# EAGLE design EMP-3 (EAGLE 5.11)
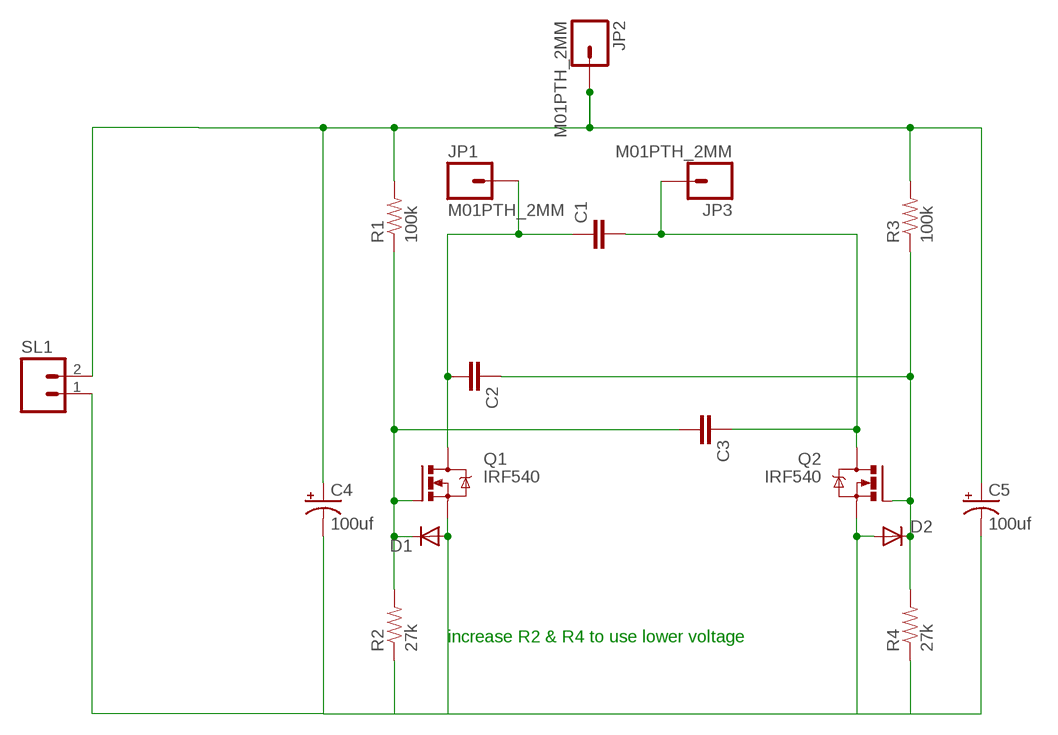
[diagram p0: schematic, sheet 1]

## Parts
C1  CAPPTH3  [CAP-PTH-LARGE]
C2  CAPPTH3  [CAP-PTH-LARGE]
C3  CAPPTH3  [CAP-PTH-LARGE]
C4  100uf  CAP_POLPTH1  [CPOL-RADIAL-100UF-25V]
C5  100uf  CAP_POLPTH1  [CPOL-RADIAL-100UF-25V]
D1  DIODESMA  [SMA-DIODE]
D2  DIODESMA  [SMA-DIODE]
JP1  M01PTH_2MM  [1X01_2MM]
JP2  M01PTH_2MM  [1X01_2MM]
JP3  M01PTH_2MM  [1X01_2MM]
Q1  IRF540  [TO220BV]
Q2  IRF540  [TO220BV]
R1  100k  RESISTOR0805-RES  [0805]
R2  27k  RESISTOR0805-RES  [0805]
R3  100k  RESISTOR0805-RES  [0805]
R4  27k  RESISTOR0805-RES  [0805]
SL1  M02  [02P]

## Nets
GND: C4.2(-) C5.2(-) D1.A D2.A Q1.S Q2.S R2.1 R4.1 SL1.1
N$2: C3.2 D1.C Q1.G R1.1 R2.2
N$5: C1.2 C3.1 JP3.1 Q2.D
N$7: C2.1 D2.C Q2.G R3.1 R4.2
N$9: C1.1 C2.2 JP1.1 Q1.D
VCC: C4.1(+) C5.1(+) JP2.1 R1.2 R3.2 SL1.2

## Notes on the sheet
- increase R2 & R4 to use lower voltage

## Library data of the parts
C1-C3 = SparkFun:CAP: Capacitor Standard 0603 ceramic capacitor, and 0.1" leaded capacitor.
C4 C5 = SparkFun:CAP_POL: Capacitor Polarized These are standard SMD and PTH capacitors. Normally 10uF, 47uF, and 100uF in electrolytic and tantalum varieties. Always verify the external diameter of the through hole cap, it varies with capacity, voltage, and manufacturer. The EIA devices should be standard.
D1 D2 = SparkFun:DIODE: Diode These are standard reverse protection diodes and small signal diodes. SMA package can handle up to about 1A. SOD-323 can handle about 200mA. What the SOD-323 package when ordering, there are some mfgs out there that are 5-pin packages.
JP1-JP3 = SparkFun:M01: Header 1 Standard 1-pin 0.1" header. Use with straight break away headers (SKU : PRT-00116), right angle break away headers (PRT-00553), swiss pins (PRT-00743), machine pins (PRT-00117), and female headers (PRT-00115).
Q1 Q2 = transistor-power:IRF540: HEXFET Power MOSFET
R1-R4 = SparkFun:RESISTOR: Resistor Basic schematic elements and footprints for 0603, 1206, and PTH resistors.
SL1 = EMP-2:M02: AMP QUICK CONNECTOR; OC_FARNELL: unknown; OC_NEWARK: unknown

## Board
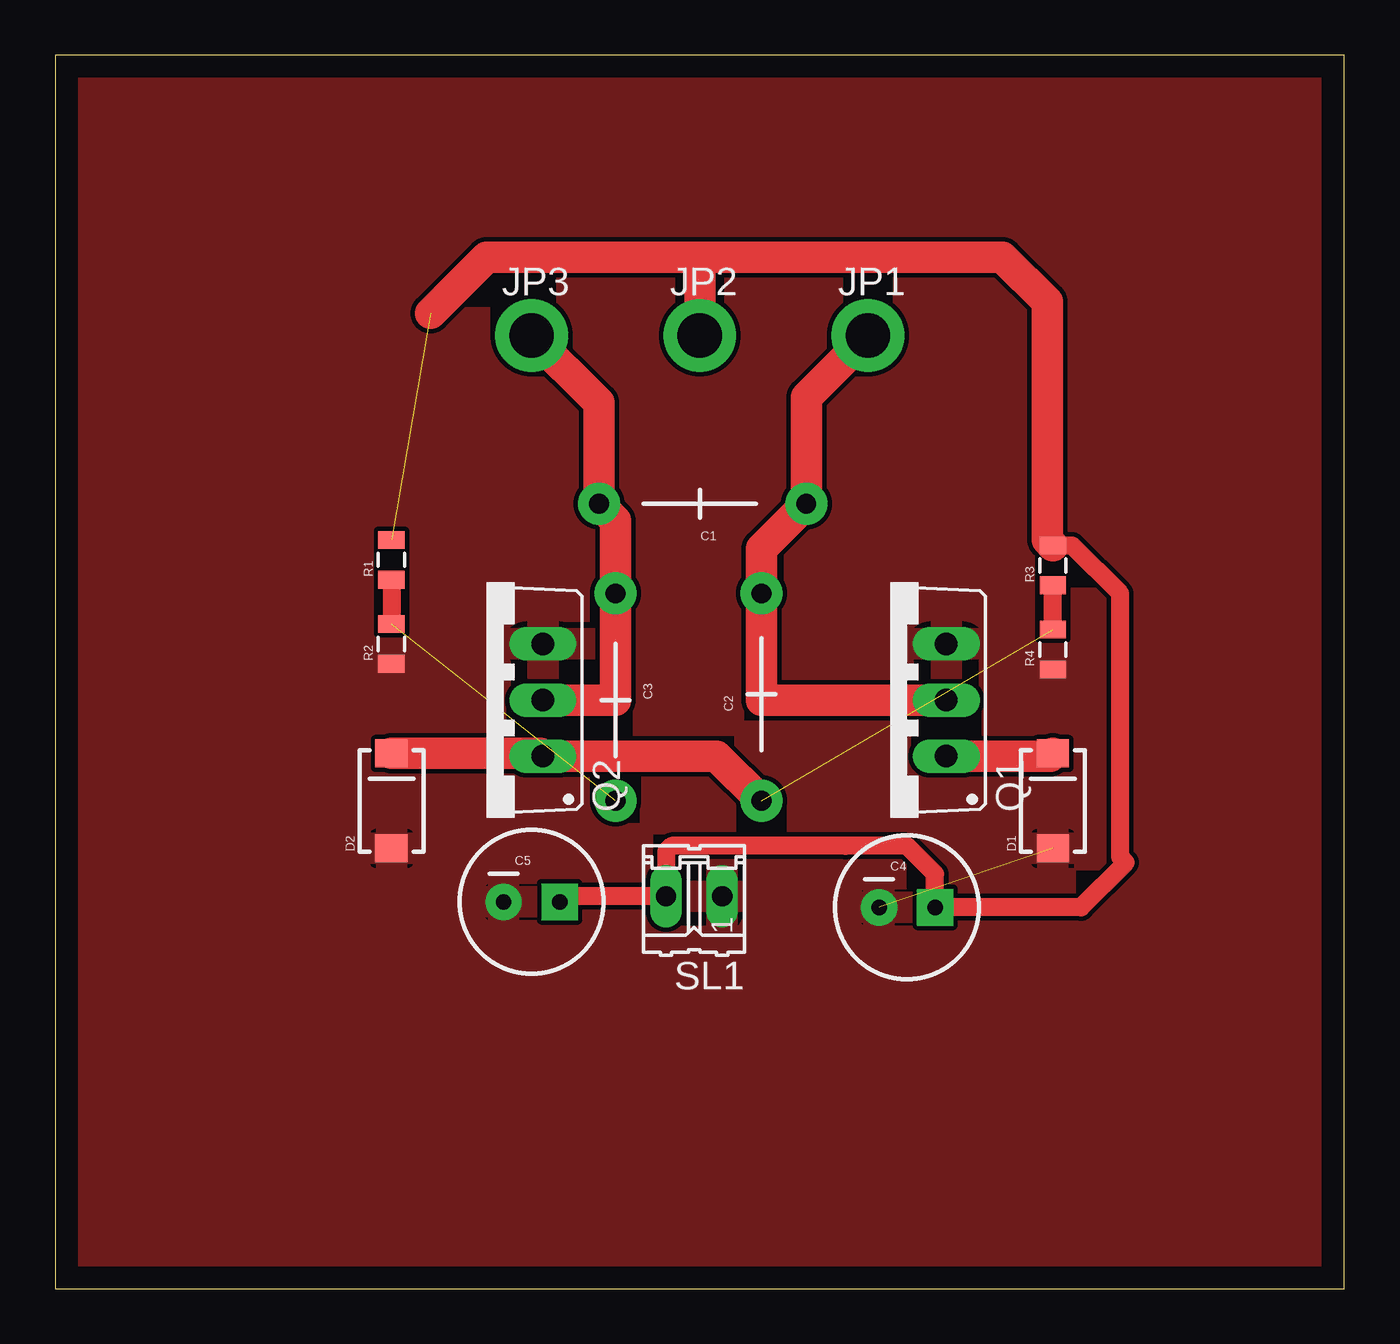
[diagram p1: board, top side]
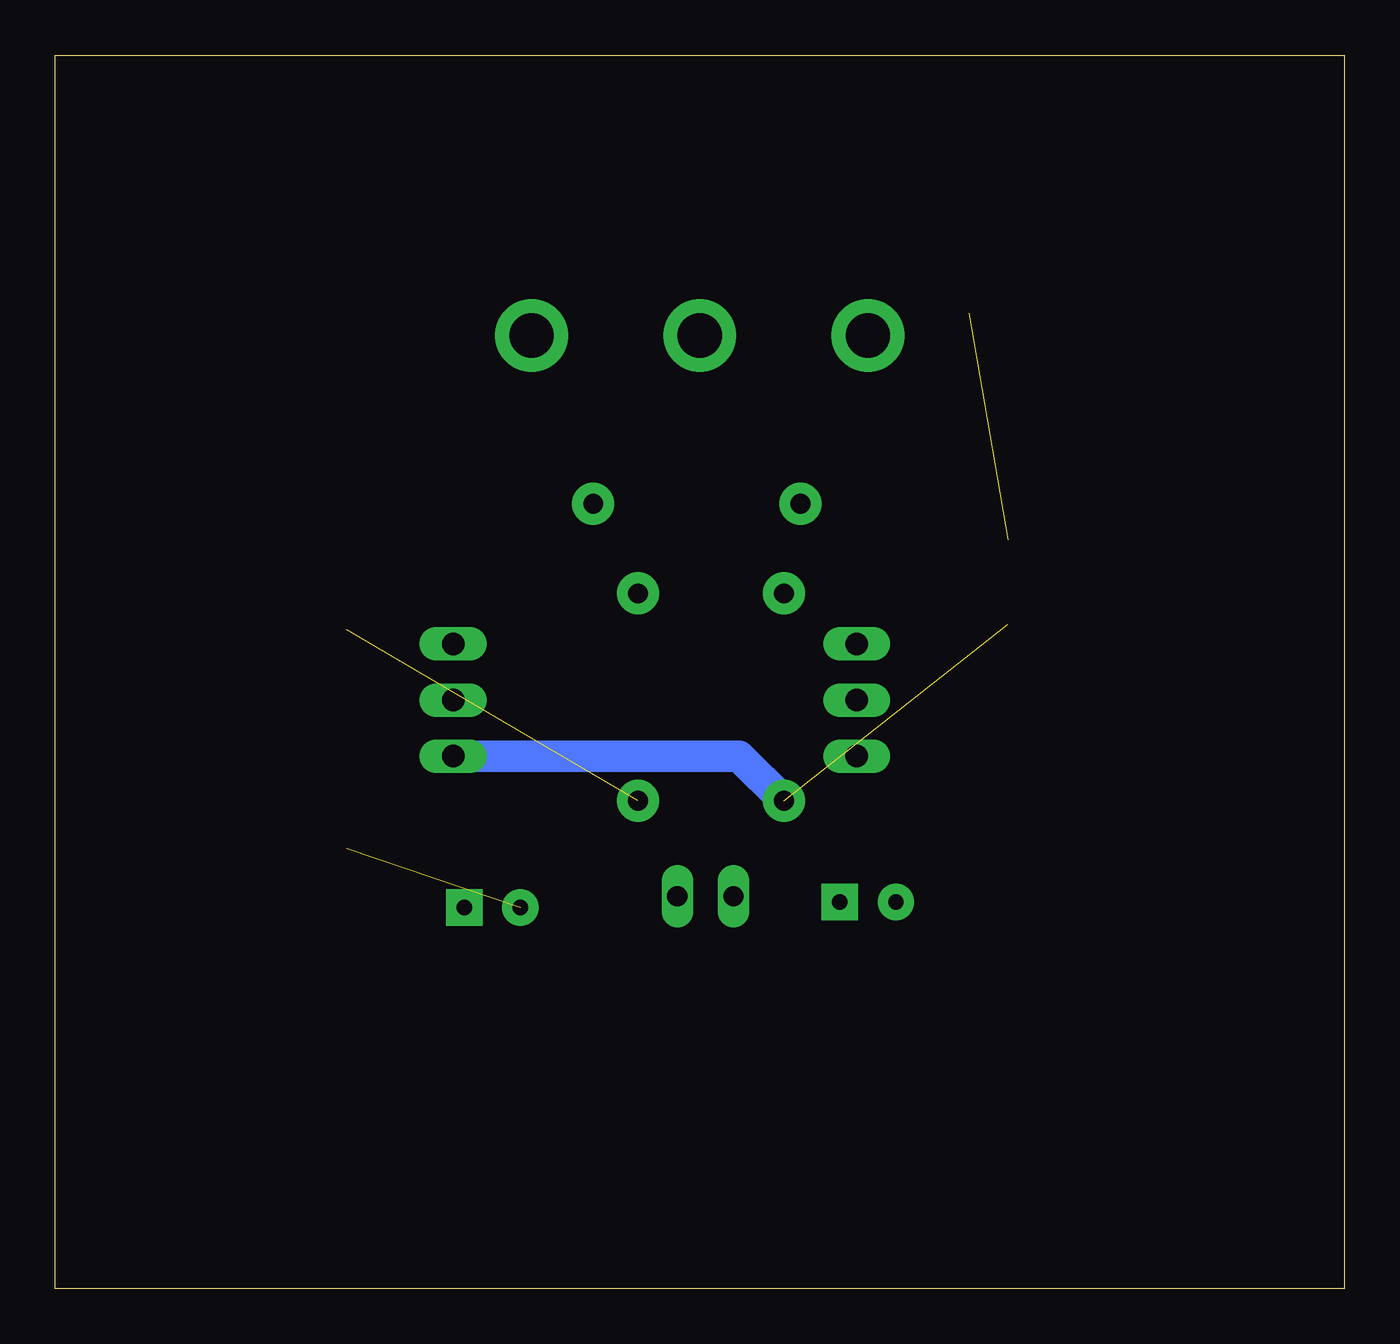
[diagram p2: board, bottom side, seen from below]

Size 58.42 x 55.88 mm. Coordinates in mm from the lower left corner, seen from the top.
Outline: 0,0 58.42,0 58.42,55.88 0,55.88 0,0
Copper layers (1*16): Top 0.035mm / dielectric 1.5mm / Bottom 0.035mm
Design rules "default": minimum track width 10mil, minimum drill 24mil, track to track 8mil, track to pad 8mil, pad to pad 8mil, via to via 8mil, smd to smd 8mil, copper to edge 40mil, drill to drill 8mil, minimum pad ring 10mil, minimum via ring 8mil, stop-mask expansion 4mil, vias tented up to drill 0mil, thermal gap 10mil

### Footprints (pad centres in the part's own frame; a part is rotated, then mirrored left to right if it is on the bottom)
CAP-PTH-LARGE = drill 0.9 pad 1.905 round: 1 -4.826,0; 2 4.572,0
CPOL-RADIAL-100UF-25V = drill 0.7 pad 1.651 square: 1 1.27,0 | drill 0.7 pad 1.651 round: 2 -1.27,0
SMA-DIODE = smd 1.27 x 1.47: A -2.15,0; C 2.15,0
1X01_2MM = drill 2 pad 3.302 round: 1 0,0
TO220BV = drill 1.016 long: D 0,-2.54; G -2.54,-2.54; S 2.54,-2.54
0805 = smd 0.8 x 1.2: 1 -0.9,0; 2 0.9,0
02P = drill 0.914 long: 1 -1.27,0; 2 1.27,0

### Placement (x,y rotation side)
C1  29.21,35.56 180 top
C2  32,26.92 90 top
C3  25.4,26.67 270 top
C4  38.61,17.27 0 top
C5  21.59,17.53 0 top
D1  45.21,22.1 90 top
D2  15.24,22.1 90 top
JP1  36.83,43.18 0 top
JP2  29.21,43.18 0 top
JP3  21.59,43.18 0 top
Q1  37.85,26.67 90 top
Q2  19.56,26.67 90 top
R1  15.24,33.02 90 top
R2  15.24,29.21 90 top
R3  45.21,32.77 90 top
R4  45.21,28.96 90 top
SL1  28.96,17.78 180 top

### Tracks (layer width: path | path; a pad name or v marks a point on that pad's centre or on a via)
GND  (1 unrouted)
  pour Top: 58.67,56.39 58.67,-0.25 0,-0.25 0,56.39
N$2  (1 unrouted)
  Top 0.813: R1.1 R2.2
  Top 1.422: Q1.G 45.09,24.13 D1.C
  Bottom 1.422: C3.2 27.43,24.13 Q1.G
N$5
  Top 1.422: Q2.D 25.4,26.67 C3.1 25.4,34.8 C1.2 24.64,40.13 JP3.1
N$7  (1 unrouted)
  Top 0.813: R4.2 R3.1
  Top 1.422: C2.1 29.97,24.13 29.46,24.13 Q2.G 21.98,24.25 D2.C
N$9
  Top 1.422: Q1.D 32,26.67 C2.2 32,33.53 C1.1 34.04,40.39 JP1.1
VCC  (1 unrouted)
  Top 0.813: R3.2 46.09,33.67 48.26,31.5 48.26,19.56 48.51,19.3 46.48,17.27 C4.1 39.88,18.8 38.61,20.07 35.81,20.07 27.94,20.07 27.69,19.81 SL1.2 23.11,17.78 C5.1
  Top 1.422: 17.02,44.2 19.56,46.74 29.46,46.74 | 29.46,46.74 42.93,46.74 44.96,44.7 44.96,33.92 R3.2 | JP2.1 29.21,46.48 29.46,46.74